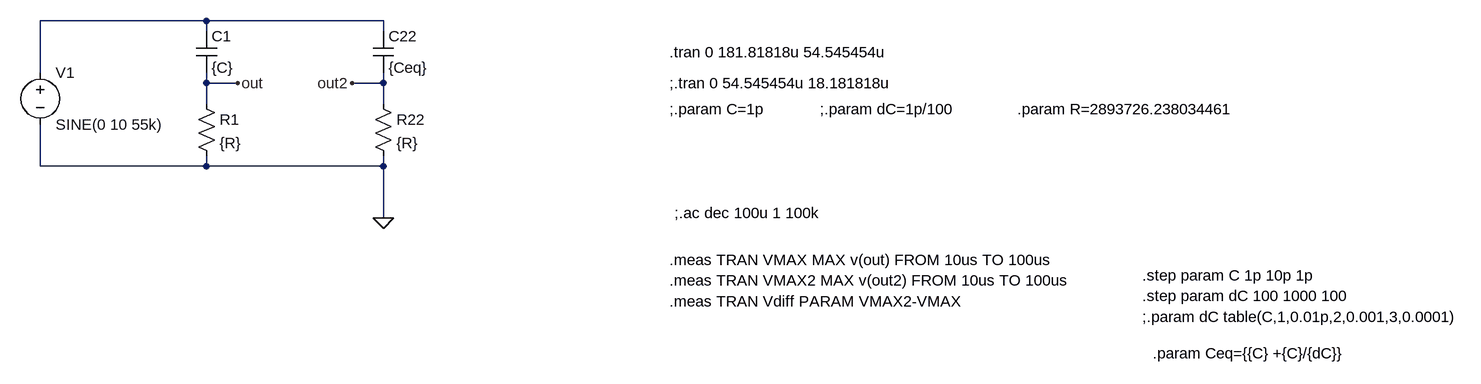
[diagram p0: schematic RC_Bridge_LTSpice.asc]
RC_Bridge_LTSpice.asc, the LTspice schematic file:
Version 4
SHEET 1 2260 680
WIRE 208 -16 -48 -16
WIRE 480 -16 208 -16
WIRE 208 0 208 -16
WIRE 480 0 480 -16
WIRE -48 64 -48 -16
WIRE 208 80 208 64
WIRE 256 80 208 80
WIRE 480 80 480 64
WIRE 480 80 432 80
WIRE 208 112 208 80
WIRE 480 112 480 80
WIRE -48 208 -48 144
WIRE 208 208 208 192
WIRE 208 208 -48 208
WIRE 480 208 480 192
WIRE 480 208 208 208
WIRE 480 288 480 208
FLAG 480 288 0
FLAG 432 80 out2
FLAG 256 80 out
SYMBOL res 192 96 R0
SYMATTR InstName R1
SYMATTR Value {R}
SYMBOL cap 192 0 R0
SYMATTR InstName C1
SYMATTR Value {C}
SYMBOL voltage -48 48 R0
WINDOW 39 0 0 Left 0
SYMATTR InstName V1
SYMATTR Value SINE(0 10 55k)
SYMBOL res 464 96 R0
SYMATTR InstName R22
SYMATTR Value {R}
SYMBOL cap 464 0 R0
SYMATTR InstName C22
SYMATTR Value {Ceq}
TEXT 928 280 Left 2 !;.ac dec 100u 1 100k
TEXT 920 80 Left 2 !;.tran 0 54.545454u 18.181818u
TEXT 920 120 Left 2 !;.param C=1p
TEXT 920 32 Left 2 !.tran 0 181.81818u 54.545454u
TEXT 920 352 Left 2 !.meas TRAN VMAX MAX v(out) FROM 10us TO 100us
TEXT 920 384 Left 2 !.meas TRAN VMAX2 MAX v(out2) FROM 10us TO 100us
TEXT 920 416 Left 2 !.meas TRAN Vdiff PARAM VMAX2-VMAX
TEXT 1648 376 Left 2 !.step param C 1p 10p 1p
TEXT 1152 120 Left 2 !;.param dC=1p/100
TEXT 1456 120 Left 2 !.param R=2893726.238034461
TEXT 1648 440 Left 2 !;.param dC table(C,1,0.01p,2,0.001,3,0.0001)
TEXT 1648 408 Left 2 !.step param dC 100 1000 100
TEXT 1664 496 Left 2 !.param Ceq={{C} +{C}/{dC}}

The netlist it stands for:
* RC_Bridge_LTSpice.asc
R1 out 0 {R}
C1 N001 out {C}
V1 N001 0 SINE(0 10 55k)
R22 out2 0 {R}
C22 N001 out2 {Ceq}
;.ac dec 100u 1 100k
;.tran 0 54.545454u 18.181818u
;.param C=1p
.tran 0 181.81818u 54.545454u
.meas TRAN VMAX MAX v(out) FROM 10us TO 100us
.meas TRAN VMAX2 MAX v(out2) FROM 10us TO 100us
.meas TRAN Vdiff PARAM VMAX2-VMAX
.step param C 1p 10p 1p
;.param dC=1p/100
.param R=2893726.238034461
;.param dC table(C,1,0.01p,2,0.001,3,0.0001)
.step param dC 100 1000 100
.param Ceq={{C} +{C}/{dC}}
.backanno
.end